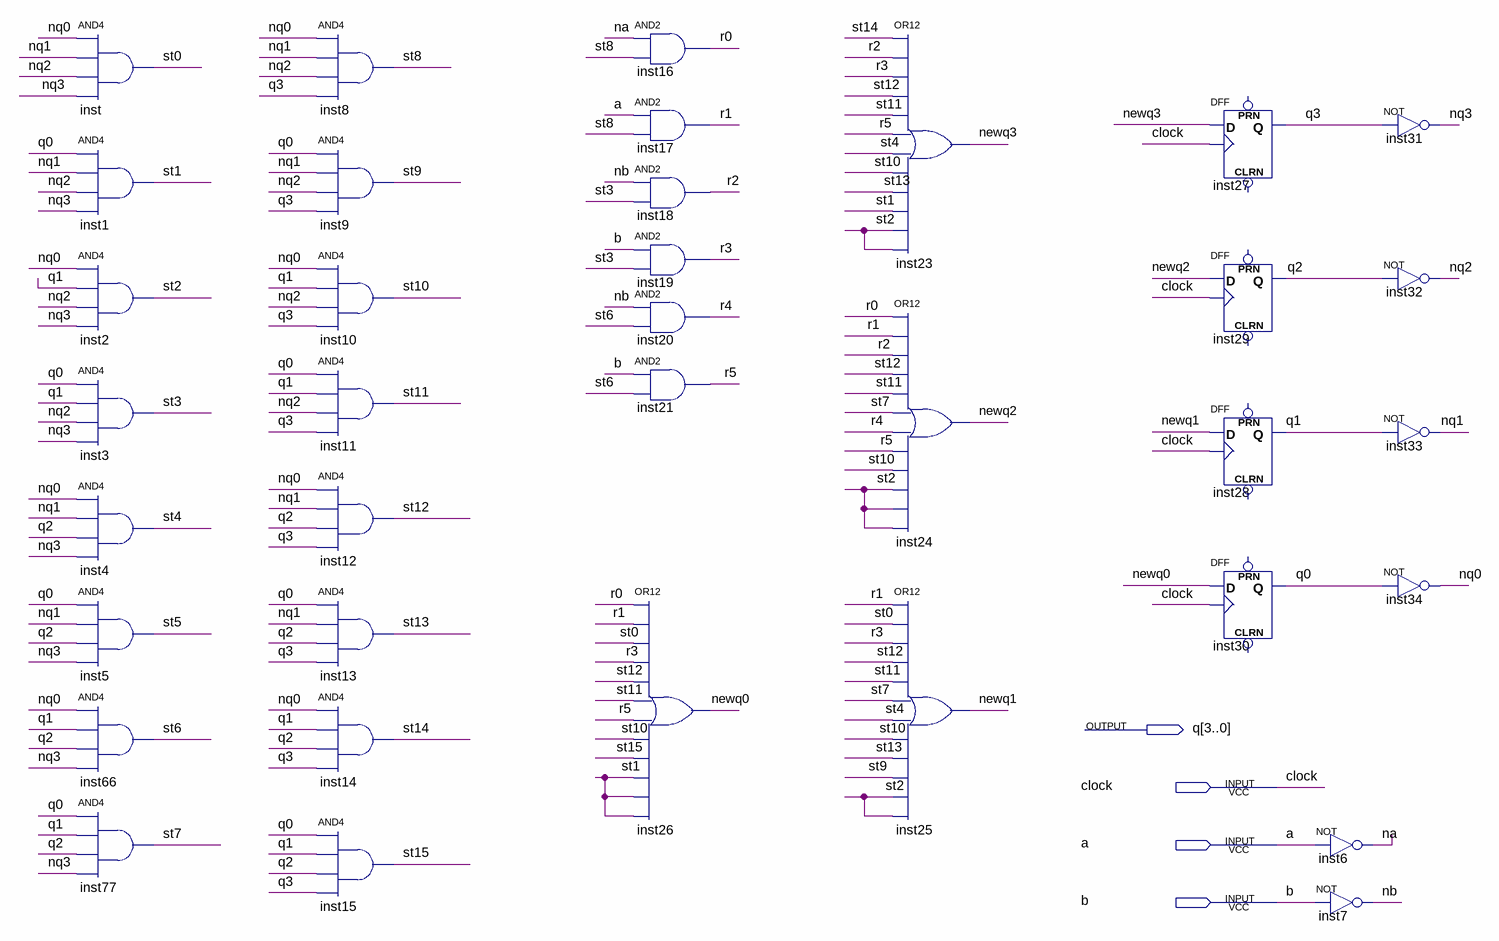
[diagram p0: schematic sheet]
// Quartus schematic lab41.bdf as structural Verilog: 36 symbols, 4 pins
module lab41 (
  input  clock,
  input  a,
  input  b,
  output [3:0] q
);

  wire na, nb, newq0, newq1, newq2, newq3, nq0, nq1, nq2, nq3, r0, r1, r2, r3, r4, r5, st0, st1, st2, st3,
       st4, st5, st6, st7, st8, st9, st10, st11, st12, st13, st14, st15;

  and inst (st0, nq0, nq1, nq2, nq3);
  and inst1 (st1, q[0], nq1, nq2, nq3);
  and inst2 (st2, nq0, q[1], nq2, nq3);
  and inst3 (st3, q[0], q[1], nq2, nq3);
  and inst4 (st4, nq0, nq1, q[2], nq3);
  and inst5 (st5, q[0], nq1, q[2], nq3);
  and inst66 (st6, nq0, q[1], q[2], nq3);
  and inst77 (st7, q[0], q[1], q[2], nq3);
  and inst8 (st8, nq0, nq1, nq2, q[3]);
  and inst9 (st9, q[0], nq1, nq2, q[3]);
  and inst10 (st10, nq0, q[1], nq2, q[3]);
  and inst11 (st11, q[0], q[1], nq2, q[3]);
  and inst12 (st12, nq0, nq1, q[2], q[3]);
  and inst13 (st13, q[0], nq1, q[2], q[3]);
  and inst14 (st14, nq0, q[1], q[2], q[3]);
  and inst15 (st15, q[0], q[1], q[2], q[3]);
  and inst16 (r0, na, st8);
  and inst17 (r1, a, st8);
  and inst18 (r2, nb, st3);
  and inst19 (r3, b, st3);
  and inst20 (r4, nb, st6);
  and inst21 (r5, b, st6);
  or inst26 (newq0, r0, r1, st0, r3, st12, st11, r5, st10, st15, st1, st1, st1);
  or inst23 (newq3, st14, r2, r3, st12, st11, r5, st4, st10, st13, st1, st2, st2);
  or inst24 (newq2, r0, r1, r2, st12, st11, st7, r4, r5, st10, st2, st2, st2);
  or inst25 (newq1, r1, st0, r3, st12, st11, st7, st4, st10, st13, st9, st2, st2);
  DFF inst27 (.CLK(clock), .D(newq3), .Q(q[3]));  // open: CLRN, PRN
  DFF inst29 (.CLK(clock), .D(newq2), .Q(q[2]));  // open: CLRN, PRN
  DFF inst28 (.CLK(clock), .D(newq1), .Q(q[1]));  // open: CLRN, PRN
  DFF inst30 (.CLK(clock), .D(newq0), .Q(q[0]));  // open: CLRN, PRN
  not inst6 (na, a);
  not inst7 (nb, b);
  not inst31 (nq3, q[3]);
  not inst32 (nq2, q[2]);
  not inst33 (nq1, q[1]);
  not inst34 (nq0, q[0]);
endmodule
